# Altium schematic sheet LEDBAKL_AP3036.SchDoc
size A3
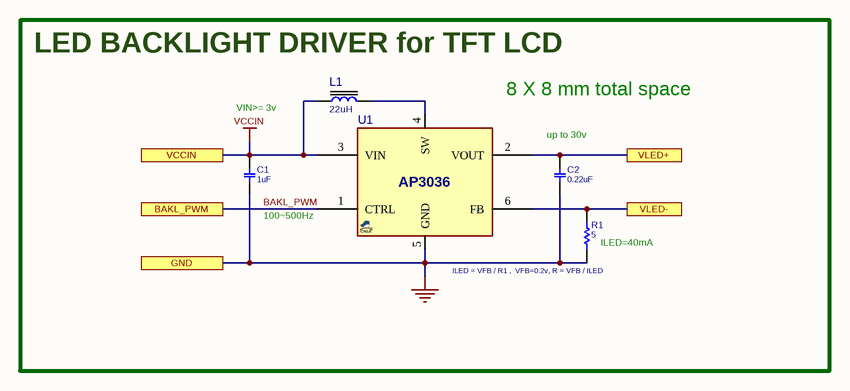
[diagram p0: LEDBAKL_AP3036.SchDoc]

## Parts
C1  1uF  [C0603]
C2  0.22uF  [C0402]
L1  22uH  [L_4]
R1  5  [R0402]
U1  AP3036  [SOT23_6]  (value not drawn)

## Ports
BAKL_PWM, GND, VCCIN, VLED+, VLED-

## Nets
GND: C1.1 C2.1 R1.2 U1.5(GND) ; port GND
VCCIN: C1.2 L1.1 U1.3(VIN) ; port VCCIN
BAKL_PWM: U1.1(CTRL) ; port BAKL_PWM
VLED+: C2.2 U1.2(VOUT) ; port VLED+
VLED-: R1.1 U1.6(FB) ; port VLED-
NetL1_2: L1.2 U1.4(SW)

## Notes on the sheet
- (near L1) LED BACKLIGHT DRIVER for TFT LCD
- VIN>= 3v
- (near U1) 8 X 8 mm total space
- (near C2) up to 30v
- 100~500Hz
- (near R1) ILED=40mA
- ILED = VFB / R1 ,  VFB=0.2v, R = VFB / ILED

## Library data of the parts
C1 = CAP_SMD_MLCC: CAP, MLCC; PARAM: X5R, 10%; MANF_P#: CL10A105KB8NNNC; MANF: Samsung; PARAM2: 50v; PRICE: 50,000:	$0.006; ASSEMBLY: ASSEMBLY; VALUE: 1uF
C2 = CAP_SMD_MLCC: CAP, MLCC; PARAM: X5R, 10%; PARAM2: 50v; PRICE: 50,000:	$0.006; MANF_P#: -; MANF: -; ASSEMBLY: ASSEMBLY; VALUE: 0.22uF
L1 = INDPWR_SMD: INDUCTOR, POWER, SMD; MANF_P#: CY43-22UH; PARAM: 600mA, 270mΩ; VALUE: 22uH
R1 = RES_SMD: RESISTOR, SMD, 20K, 0402; MANF: Yageo; PARAM: 0.063W; DIST#: MOUSER; PARAM2: 1%; MANF_P#: RK73H1ETTP2002F; ASSEMBLY: ASSEMBLY; PRICE: 100= 0.5$; DESC: RESISTOR, SMD, 20K, 0402; VALUE: 5
U1 = VREG_AP3036_SOT23: REG, Switching, Boost, 0.55A, ADJ, 1MHz, SOT-23-6; PARAM: 0.55A, 1MHz, -40~85oC; PARAM2: 2.5~16VIN; MANF_P#: AP3036K, AP3036BK; MANF: Diodes; PRICE: 0.3$; VALUE: AP3036